# Altium project 6502.PrjPcb
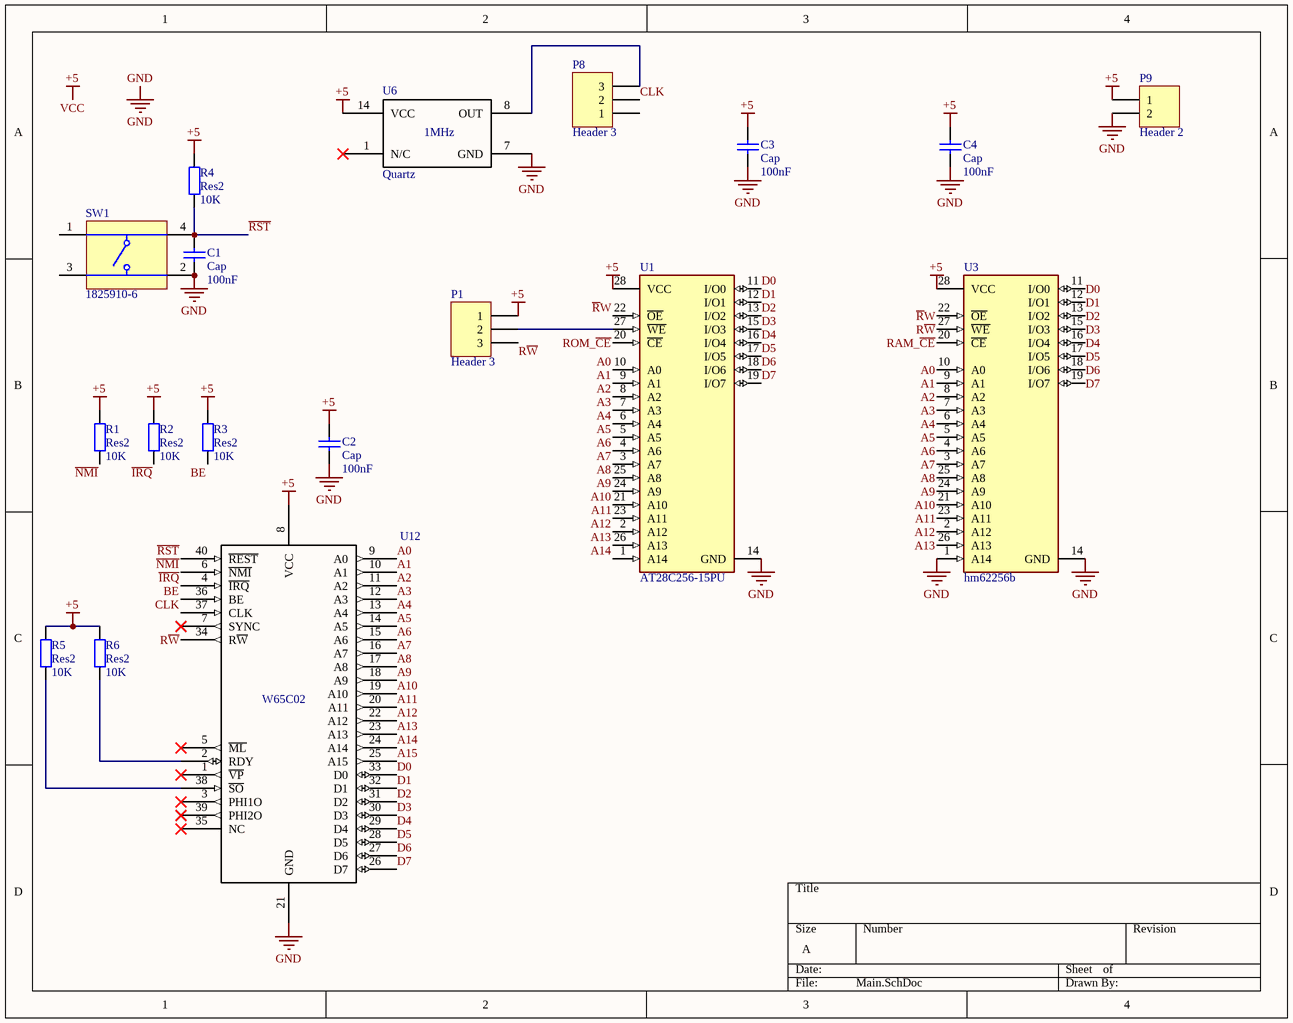
[diagram p0: Main.SchDoc]
3 sheets, 34 parts. Net scope: global (net labels, ports and power ports of the same name join across sheets).
Board file: 6502.PcbDoc
Sheets:
  Main.SchDoc
  PIO.SchDoc
  BusSelect.SchDoc

## Sheet Main.SchDoc
size A

### Parts
C1  Cap  value 100nF  [Ceramic Capacitor]
C2  Cap  value 100nF  [Ceramic Capacitor]
C3  Cap  value 100nF  [Ceramic Capacitor]
C4  Cap  value 100nF  [Ceramic Capacitor]
P1  Header 3  [HDR1X3]
P8  Header 3  [HDR1X3]
P9  Header 2  [HDR1X2]
R1  Res2  value 10K  [AXIAL-0.4]
R2  Res2  value 10K  [AXIAL-0.4]
R3  Res2  value 10K  [AXIAL-0.4]
R4  Res2  value 10K  [AXIAL-0.4]
R5  Res2  value 10K  [AXIAL-0.4]
R6  Res2  value 10K  [AXIAL-0.4]
SW1  1825910-6  [TECO-1825910-6_V]
U1  AT28C256-15PU  [FP-28P6-MFG]
U3  hm62256b  [FP-28P6-MFG]
U6  Quartz  [Quartz]
U12  W65C02  [DIP40]

### Nets
GND: C1.2 C2.2 C3.2 C4.2 P9.2 SW1.2 U1.14(GND) U3.1(A14) U3.14(GND) U6.7(GND) U12.21(GND)
VCC: C2.1 C3.1 C4.1 P1.1 P9.1 R1.2 R2.2 R3.2 R4.2 R5.2 R6.2 U1.28(VCC) U3.28(VCC) U6.14(VCC) U12.8(VCC)  [also labelled +5]
A0: U1.10(A0) U3.10(A0) U12.9(A0)
A1: U1.9(A1) U3.9(A1) U12.10(A1)
A2: U1.8(A2) U3.8(A2) U12.11(A2)
A3: U1.7(A3) U3.7(A3) U12.12(A3)
A4: U1.6(A4) U3.6(A4) U12.13(A4)
A5: U1.5(A5) U3.5(A5) U12.14(A5)
A6: U1.4(A6) U3.4(A6) U12.15(A6)
A7: U1.3(A7) U3.3(A7) U12.16(A7)
A8: U1.25(A8) U3.25(A8) U12.17(A8)
A9: U1.24(A9) U3.24(A9) U12.18(A9)
A10: U1.21(A10) U3.21(A10) U12.19(A10)
A11: U1.23(A11) U3.23(A11) U12.20(A11)
A12: U1.2(A12) U3.2(A12) U12.22(A12)
A13: U1.26(A13) U3.26(A13) U12.23(A13)
A14: U1.1(A14) U12.24(A14)
A15: U12.25(A15)
BE: R3.1 U12.36(BE)
CLK: P8.2 U12.37(CLK)
D0: U1.11(I/O0) U3.11(I/O0) U12.33(D0)
D1: U1.12(I/O1) U3.12(I/O1) U12.32(D1)
D2: U1.13(I/O2) U3.13(I/O2) U12.31(D2)
D3: U1.15(I/O3) U3.15(I/O3) U12.30(D3)
D4: U1.16(I/O4) U3.16(I/O4) U12.29(D4)
D5: U1.17(I/O5) U3.17(I/O5) U12.28(D5)
D6: U1.18(I/O6) U3.18(I/O6) U12.27(D6)
D7: U1.19(I/O7) U3.19(I/O7) U12.26(D7)
~{IRQ}: R2.1 U12.4(~{IRQ})
~{NMI}: R1.1 U12.6(~{NMI})
~{RST}: C1.1 R4.1 SW1.4 U12.40(~{REST})
~{R}W: U1.22(~{OE}) U3.22(~{OE})
RAM_~{CE}: U3.20(~{CE})
ROM_~{CE}: U1.20(~{CE})
R~{W}: P1.3 U3.27(~{WE}) U12.34(R~{W})
NetP1_2: P1.2 U1.27(~{WE})
NetP8_3: P8.3 U6.8(OUT)
NetR5_1: R5.1 U12.38(~{SO})
NetR6_1: R6.1 U12.2(RDY)

Not connected (* = marked no-connect by the designer): P8 1; SW1 1 3; U6 1(N/C)*; U12 1(~{VP})* 3(PHI1O)* 5(~{ML})* 7(SYNC)* 35(NC)* 39(PHI2O)*

### Notes on the sheet
- (in symbol Quartz) 1MHz

### Library data of the parts
C1-C4 = Cap: Capacitor; Published: 8-Jun-2000; LatestRevisionDate: 17-Jul-2002; LatestRevisionNote: Re-released for DXP Platform.; PackageReference: RAD-0.3; Publisher: Altium Limited; PackageDescription: Radial Cap, Thru-Hole; 2 Leads; 0.3 in Pin Spacing
P1 P8 = Header 3: Header, 3-Pin; LatestRevisionDate: 17-Jul-2002; LatestRevisionNote: Re-released for DXP Platform.; Publisher: Altium Limited
P9 = Header 2: Header, 2-Pin; LatestRevisionDate: 17-Jul-2002; LatestRevisionNote: Re-released for DXP Platform.; Publisher: Altium Limited
R1-R6 = Res2: Resistor; Published: 8-Jun-2000; LatestRevisionDate: 17-Jul-2002; LatestRevisionNote: Re-released for DXP Platform.; PackageReference: AXIAL-0.4; Publisher: Altium Limited; PackageDescription: Axial Device, Thru-Hole; 2 Leads; 0.4 in Pin Spacing
SW1 = CMP-1684-00021-1: Tact Switch, SPST-NO, 0.05 A, -35 to 85 degC, 4-Pin THD, RoHS, Bulk; Manufacturer: TE Connectivity; Maximum Contact Resistance: 100mOhm; Mechanical Life: 100000Cycles; Bushing Type: Unthreaded; Switch Configuration: OFF(ON); Maximum DC Voltage Rating: 24V; Contact Rating @ Voltage: 0.05A@24VDC; Actuator Color: Black; Body Orientation: Straight; Function: MomentaryContact; Illumination: N/R; Actuator Style: RoundButton; Actuator Material: PolybutyleneTerephthalate; Dielectric Strength: 500VAC; Pole Throw Configuration: SPST; Actuator Length: 1.4mm; Product Weight: N/A; Contact Material: CopperAlloy; Housing Material: N/A; Terminal Type: PCPins; Minimum Insulation Resistance: 100MOhm; Package Description: 4-Pin Through Hole Device, Body 5.99 x 5.99 mm, Pitch 6.5 mm; Part No: 1825910-6; Package Reference: THD; Base Material: N/A; Manufacturer URL: http://www.te.com; Contact Plating: Silver; RoHS: Yes; Datasheet Version: Rev. C9; Electrical Life: 100000Cycles; Maximum AC Voltage Rating: N/A; Thread Size: N/R; Operating Temperature: -35to85C; Mounting: ThroughHole; Dimension: 5.99x5mm; Datasheet URL: http://www.te.com/commerce/DocumentDelivery/DDEController?Action=showdoc&DocId=Customer+Drawing%7F1825910%7FC9%7Fpdf%7FEnglish%7FENG_CD_1825910_C9.pdf%7F1825910-6; Family: 1825910; Seal Location: N/A; Seal Description: N/A; Packaging: N/A
U1 = CMP-06313-000003-1: IC EEPROM 256K PARALLEL 28DIP; Manufacturer: Microchip; Max Supply Voltage: 5.5V; Nominal Supply Current: 50mA; Memory Size: 256Kbits; Access Time: 150ns; Min Supply Voltage: 4.5V; Standoff Height: 0.381mm; Digikey Description: IC EEPROM 256K PARALLEL 28DIP; Device Class L3: EEPROM; Temperature: -40°C to +85°C; RoHS: TRUE; Device Class L1: Integrated Circuits (ICs); ComponentLink2Description: Datasheet; Memory Type: EEPROM; Package: 28P6; Interface: Parallel; Manufacturer Part Number: AT28C256-15PU; Device Class L2: Memory; ComponentLink2URL: http://ww1.microchip.com/downloads/en/DeviceDoc/doc0006.pdf; Temperature Range Low: -40°C; Category: IC; Lead Free: Yes; Automotive: No; Ipc Land Pattern Name: DIP1556W46P254L3734H483Q28; Height: 4.826mm; Octopart: https://octopart.com/at28c256-15pu-microchip-77758240; Temperature Range High: +85°C
U3 = CMP-06313-000003-1: RAM; Manufacturer Part Number: AT28C256-15PU; Manufacturer: Microchip; Max Supply Voltage: 5.5V; Memory Type: EEPROM; Interface: Parallel; Nominal Supply Current: 50mA; Memory Size: 256Kbits; Access Time: 150ns; Min Supply Voltage: 4.5V; Standoff Height: 0.381mm; Digikey Description: IC EEPROM 256K PARALLEL 28DIP; Device Class L3: EEPROM; Temperature: -40°C to +85°C; RoHS: TRUE; Device Class L1: Integrated Circuits (ICs); ComponentLink2Description: Datasheet; Package: 28P6; Device Class L2: Memory; ComponentLink2URL: http://ww1.microchip.com/downloads/en/DeviceDoc/doc0006.pdf; Temperature Range Low: -40°C; Category: IC; Lead Free: Yes; Automotive: No; Ipc Land Pattern Name: DIP1556W46P254L3734H483Q28; Height: 4.826mm; Octopart: https://octopart.com/at28c256-15pu-microchip-77758240; Temperature Range High: +85°C

## Sheet PIO.SchDoc
size A
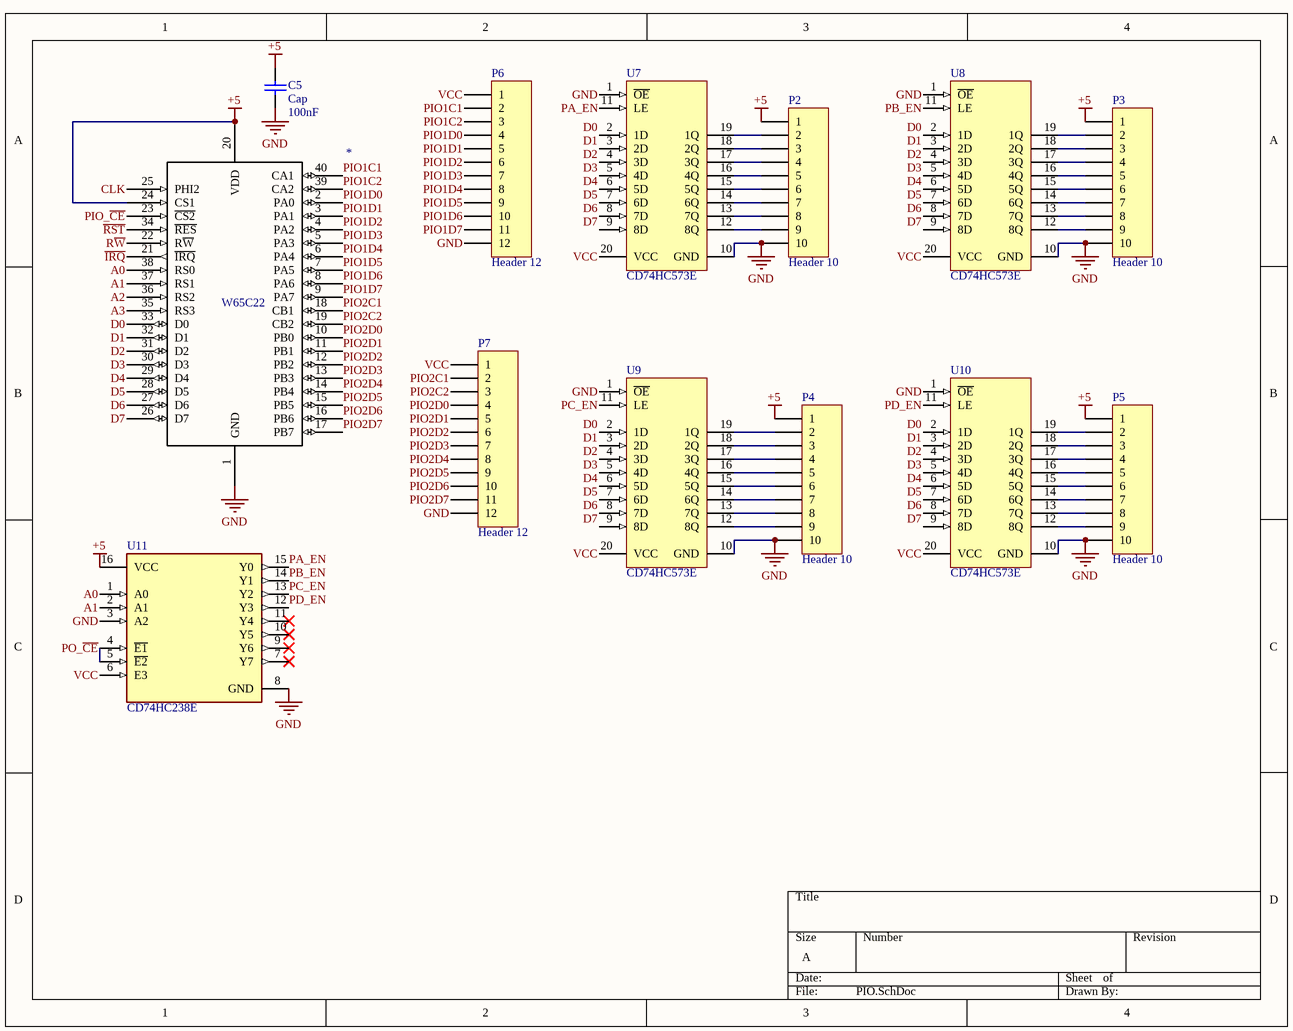
[diagram p1: PIO.SchDoc]

### Parts
*  W65C22  [DIP40]
C5  Cap  value 100nF  [Ceramic Capacitor]
P2  Header 10  [HDR1X10]
P3  Header 10  [HDR1X10]
P4  Header 10  [HDR1X10]
P5  Header 10  [HDR1X10]
P6  Header 12  [HDR1X12]
P7  Header 12  [HDR1X12]
U7  CD74HC573E  [N0020A]
U8  CD74HC573E  [N0020A]
U9  CD74HC573E  [N0020A]
U10  CD74HC573E  [N0020A]
U11  CD74HC238E  [FP-N0016A-MFG]

### Nets
GND: *.1(GND) C5.2 P2.10 P3.10 P4.10 P5.10 P6.12 P7.12 U7.1(~{OE}) U7.10(GND) U8.1(~{OE}) U8.10(GND) U9.1(~{OE}) U9.10(GND) U10.1(~{OE}) U10.10(GND) U11.3(A2) U11.8(GND)
VCC: *.20(VDD) *.24(CS1) C5.1 P2.1 P3.1 P4.1 P5.1 P6.1 P7.1 U7.20(VCC) U8.20(VCC) U9.20(VCC) U10.20(VCC) U11.6(E3) U11.16(VCC)  [also labelled +5]
A0: *.38(RS0) U11.1(A0)
A1: *.37(RS1) U11.2(A1)
A2: *.36(RS2)
A3: *.35(RS3)
CLK: *.25(PHI2)
D0: *.33(D0) U7.2(1D) U8.2(1D) U9.2(1D) U10.2(1D)
D1: *.32(D1) U7.3(2D) U8.3(2D) U9.3(2D) U10.3(2D)
D2: *.31(D2) U7.4(3D) U8.4(3D) U9.4(3D) U10.4(3D)
D3: *.30(D3) U7.5(4D) U8.5(4D) U9.5(4D) U10.5(4D)
D4: *.29(D4) U7.6(5D) U8.6(5D) U9.6(5D) U10.6(5D)
D5: *.28(D5) U7.7(6D) U8.7(6D) U9.7(6D) U10.7(6D)
D6: *.27(D6) U7.8(7D) U8.8(7D) U9.8(7D) U10.8(7D)
D7: *.26(D7) U7.9(8D) U8.9(8D) U9.9(8D) U10.9(8D)
~{IRQ}: *.21(~{IRQ})
PA_EN: U7.11(LE) U11.15(Y0)
PB_EN: U8.11(LE) U11.14(Y1)
PC_EN: U9.11(LE) U11.13(Y2)
PD_EN: U10.11(LE) U11.12(Y3)
PIO1C1: *.40(CA1) P6.2
PIO1C2: *.39(CA2) P6.3
PIO1D0: *.2(PA0) P6.4
PIO1D1: *.3(PA1) P6.5
PIO1D2: *.4(PA2) P6.6
PIO1D3: *.5(PA3) P6.7
PIO1D4: *.6(PA4) P6.8
PIO1D5: *.7(PA5) P6.9
PIO1D6: *.8(PA6) P6.10
PIO1D7: *.9(PA7) P6.11
PIO2C1: *.18(CB1) P7.2
PIO2C2: *.19(CB2) P7.3
PIO2D0: *.10(PB0) P7.4
PIO2D1: *.11(PB1) P7.5
PIO2D2: *.12(PB2) P7.6
PIO2D3: *.13(PB3) P7.7
PIO2D4: *.14(PB4) P7.8
PIO2D5: *.15(PB5) P7.9
PIO2D6: *.16(PB6) P7.10
PIO2D7: *.17(PB7) P7.11
PIO_~{CE}: *.23(~{CS2})
PO_~{CE}: U11.4(~{E1}) U11.5(~{E2})
~{RST}: *.34(~{RES})
R~{W}: *.22(R~{W})
NetP2_2: P2.2 U7.19(1Q)
NetP2_3: P2.3 U7.18(2Q)
NetP2_4: P2.4 U7.17(3Q)
NetP2_5: P2.5 U7.16(4Q)
NetP2_6: P2.6 U7.15(5Q)
NetP2_7: P2.7 U7.14(6Q)
NetP2_8: P2.8 U7.13(7Q)
NetP2_9: P2.9 U7.12(8Q)
NetP3_2: P3.2 U8.19(1Q)
NetP3_3: P3.3 U8.18(2Q)
NetP3_4: P3.4 U8.17(3Q)
NetP3_5: P3.5 U8.16(4Q)
NetP3_6: P3.6 U8.15(5Q)
NetP3_7: P3.7 U8.14(6Q)
NetP3_8: P3.8 U8.13(7Q)
NetP3_9: P3.9 U8.12(8Q)
NetP4_2: P4.2 U9.19(1Q)
NetP4_3: P4.3 U9.18(2Q)
NetP4_4: P4.4 U9.17(3Q)
NetP4_5: P4.5 U9.16(4Q)
NetP4_6: P4.6 U9.15(5Q)
NetP4_7: P4.7 U9.14(6Q)
NetP4_8: P4.8 U9.13(7Q)
NetP4_9: P4.9 U9.12(8Q)
NetP5_2: P5.2 U10.19(1Q)
NetP5_3: P5.3 U10.18(2Q)
NetP5_4: P5.4 U10.17(3Q)
NetP5_5: P5.5 U10.16(4Q)
NetP5_6: P5.6 U10.15(5Q)
NetP5_7: P5.7 U10.14(6Q)
NetP5_8: P5.8 U10.13(7Q)
NetP5_9: P5.9 U10.12(8Q)

Not connected (* = marked no-connect by the designer): U11 7(Y7)* 9(Y6)* 10(Y5)* 11(Y4)*

### Library data of the parts
C5 = Cap: Capacitor; Published: 8-Jun-2000; LatestRevisionDate: 17-Jul-2002; LatestRevisionNote: Re-released for DXP Platform.; PackageReference: RAD-0.3; Publisher: Altium Limited; PackageDescription: Radial Cap, Thru-Hole; 2 Leads; 0.3 in Pin Spacing
P2-P5 = Header 10: Header, 10-Pin; LatestRevisionDate: 17-Jul-2002; LatestRevisionNote: Re-released for DXP Platform.; Publisher: Altium Limited
P6 P7 = Header 12: Header, 12-Pin; LatestRevisionDate: 17-Jul-2002; LatestRevisionNote: Re-released for DXP Platform.; Publisher: Altium Limited
U7-U10 = CMP-1621-00360-2: High Speed CMOS Logic Octal Transparent Latches with 3-State Outputs, N0020A, TUBE; Manufacturer: Texas Instruments; Output Drive (IOL/IOH)(Max)(mA): 7.8/-7.8; Schmitt Trigger: No; Bits(#): 8; Technology Family: HC; Output Logic: Inverted; Voltage(Nom)(V): 6; tpd @ Nom Voltage(Max)(ns): 37; 3-State Output: Yes; ICC @ Nom Voltage(Max)(mA): 0.08; F @ Nom Voltage(Max)(Mhz): 28; Rating: Catalog; VCC(Min)(V): 2; Generic Part Number: CD74HC573; PackageReference: N0020A; Input Type: CMOS; DatasheetVersion: SCLS454A; VCC(Max)(V): 6; Output Type: CMOS; Code_JEDEC: MS-001; Operating Temperature Range(C): -55 to 125
U11 = CMP-1633-00674-3: IC DECODER/DEMUX 1X3:8 16DIP; Low Level Output Current: 5.2mA; Number of Inputs: 3; Number of Bits: 8; High Level Output Current: -5.2mA; Turn-On Delay Time: 265ns; Bandwidth: 28MHz; Number of Channels: 1; Polarity: Non-Inverting; Quiescent Current: 8uA; Propagation Delay: 13ns; Supply Type: Single; Logic Function: Demultiplexer; Min Supply Voltage: 2V; Max Supply Voltage: 6V; Packaging: Rail/Tube; Number of Pins: 16; Number of Input Lines: 3; RoHS Compliant: Yes; Mount: Through Hole; Max Operating Temperature: 125°C; Package Quantity: 25; Number of Elements: 1; Min Operating Temperature: -55°C; Number of Outputs: 8; Contact Plating: Gold; Lead Free: Lead Free; Independent Circuits: 1; Number of Output Lines: 8; Weight: 0.03357oz; Case/Package: PDIP; Radiation Hardening: No; REACH SVHC: No SVHC

## Sheet BusSelect.SchDoc
size A
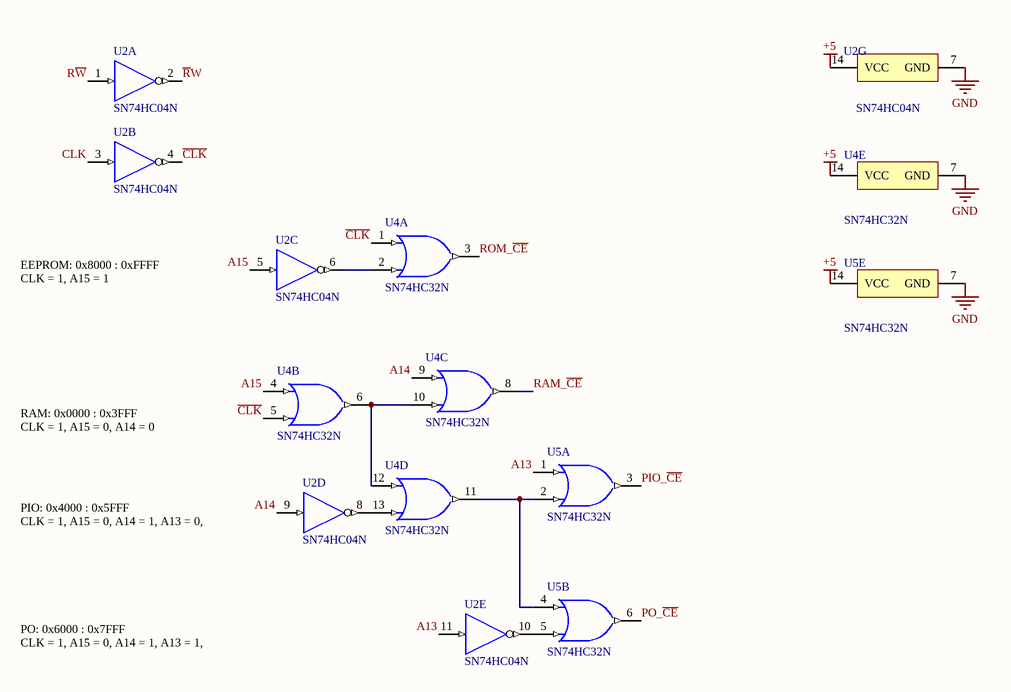
[diagram p2: BusSelect.SchDoc]

### Parts
U2  SN74HC04N  [N0014A]  (parts A,B,C,D,E,G of 7)
U4  SN74HC32N  [N0014A]  (parts A,B,C,D,E of 5)
U5  SN74HC32N  [N0014A]  (parts A,B,E of 5)

### Nets
+5: U2.14(VCC) U4.14(VCC) U5.14(VCC)  [project net VCC]
GND: U2.7(GND) U4.7(GND) U5.7(GND)
A13: U2.11(5A) U5.1(1A)
A14: U2.9(4A) U4.9(3A)
A15: U2.5(3A) U4.4(2A)
~{CLK}: U2.4(~{2Y}) U4.1(1A) U4.5(2B)
CLK: U2.3(2A)
PIO_~{CE}: U5.3(1Y)
PO_~{CE}: U5.6(2Y)
~{R}W: U2.2(~{1Y})
RAM_~{CE}: U4.8(3Y)
ROM_~{CE}: U4.3(1Y)
R~{W}: U2.1(1A)
NetU2_6: U2.6(~{3Y}) U4.2(1B)
NetU2_8: U2.8(~{4Y}) U4.13(4B)
NetU2_10: U2.10(~{5Y}) U5.5(2B)
NetU4_6: U4.6(2Y) U4.10(3B) U4.12(4A)
NetU4_11: U4.11(4Y) U5.2(1B) U5.4(2A)

### Notes on the sheet
- EEPROM: 0x8000 : 0xFFFF
  CLK = 1, A15 = 1
- RAM: 0x0000 : 0x3FFF
  CLK = 1, A15 = 0, A14 = 0
- PIO: 0x4000 : 0x5FFF
  CLK = 1, A15 = 0, A14 = 1, A13 = 0,
- PO: 0x6000 : 0x7FFF
  CLK = 1, A15 = 0, A14 = 1, A13 = 1,

### Library data of the parts
U2 = CMP-1615-00892-2: Hex Inverters, N0014A, TUBE; Manufacturer: Texas Instruments; VCC(Min)(V): 2; Bits(#): 6; Technology Family: HC; tpd @ Nom Voltage(Max)(ns): 20; Output Drive (IOL/IOH)(Max)(mA): -4/4; Rating: Catalog; Voltage(Nom)(V): 5; Schmitt Trigger: No; ICC @ Nom Voltage(Max)(mA): 0.02; Input Type: CMOS; Code_JEDEC: MS-001; PackageReference: N0014A; DatasheetVersion: SCLS078F; Output Type: CMOS; VCC(Max)(V): 6; Operating Temperature Range(C): -40 to 85; Generic Part Number: SN74HC04; F @ Nom Voltage(Max)(Mhz): 20
U4 U5 = CMP-1573-00148-3: Quadruple 2-Input Positive-OR Gates, N0014A, TUBE; Manufacturer: Texas Instruments; Output Type: CMOS; Rating: Catalog; ICC @ Nom Voltage(Max)(mA): 0.02; VCC(Min)(V): 2; VCC(Max)(V): 6; Bits(#): 4; tpd @ Nom Voltage(Max)(ns): 25; Voltage(Nom)(V): 5; F @ Nom Voltage(Max)(Mhz): 70; Output Drive (IOL/IOH)(Max)(mA): 5.2/-5.2; PackageVersion: http://www.ti.com/lit/ml/mpdi002c/mpdi002c.pdf; Operating Temperature Range(C): -40 to 85; Code_JEDEC: MS-001; DatasheetVersion: SCLS200D; Generic Part Number: SN74HC32; Input Type: CMOS; PackageReference: N0014A

## Nets that join several sheets
GND: Main (11 pins), PIO (18 pins), BusSelect (U2.7 U4.7 U5.7)
VCC: Main (15 pins), PIO (15 pins), BusSelect (U2.14 U4.14 U5.14)
A0: Main (U1.10 U3.10 U12.9), PIO (*.38 U11.1)
A1: Main (U1.9 U3.9 U12.10), PIO (*.37 U11.2)
A2: Main (U1.8 U3.8 U12.11), PIO (*.36)
A3: Main (U1.7 U3.7 U12.12), PIO (*.35)
A13: Main (U1.26 U3.26 U12.23), BusSelect (U2.11 U5.1)
A14: Main (U1.1 U12.24), BusSelect (U2.9 U4.9)
A15: Main (U12.25), BusSelect (U2.5 U4.4)
CLK: Main (P8.2 U12.37), PIO (*.25), BusSelect (U2.3)
D0: Main (U1.11 U3.11 U12.33), PIO (5 pins)
D1: Main (U1.12 U3.12 U12.32), PIO (5 pins)
D2: Main (U1.13 U3.13 U12.31), PIO (5 pins)
D3: Main (U1.15 U3.15 U12.30), PIO (5 pins)
D4: Main (U1.16 U3.16 U12.29), PIO (5 pins)
D5: Main (U1.17 U3.17 U12.28), PIO (5 pins)
D6: Main (U1.18 U3.18 U12.27), PIO (5 pins)
D7: Main (U1.19 U3.19 U12.26), PIO (5 pins)
~{IRQ}: Main (R2.1 U12.4), PIO (*.21)
PIO_~{CE}: PIO (*.23), BusSelect (U5.3)
PO_~{CE}: PIO (U11.4 U11.5), BusSelect (U5.6)
~{RST}: Main (C1.1 R4.1 SW1.4 U12.40), PIO (*.34)
~{R}W: Main (U1.22 U3.22), BusSelect (U2.2)
RAM_~{CE}: Main (U3.20), BusSelect (U4.8)
ROM_~{CE}: Main (U1.20), BusSelect (U4.3)
R~{W}: Main (P1.3 U3.27 U12.34), PIO (*.22), BusSelect (U2.1)